# Altium schematic sheet 5 - Position2Go_PowerSupply_and_Connectors.SchDoc
size A3; Release: RC00; PageSetup: Record=PageOptions|CenterHorizontal=True|CenterVertical=True|PrintScale=1.01|XCorrection=1.00|YCorrection=1.00|PrintKind=0|BorderSize=5000000|LeftOffset=0|BottomOffset=0|Orientation=2|PaperLength=1000|PaperWidth=1000|Scale=100|PaperSource=7|PrintQuality=-4|MediaType=1|DitherType=10|PaperKind=A3|PrintScaleMode=1; Doc_ConfidentialStatus: <Doc_ConfidentialStatus>; Doc_Preliminary: <Doc_Preliminary>
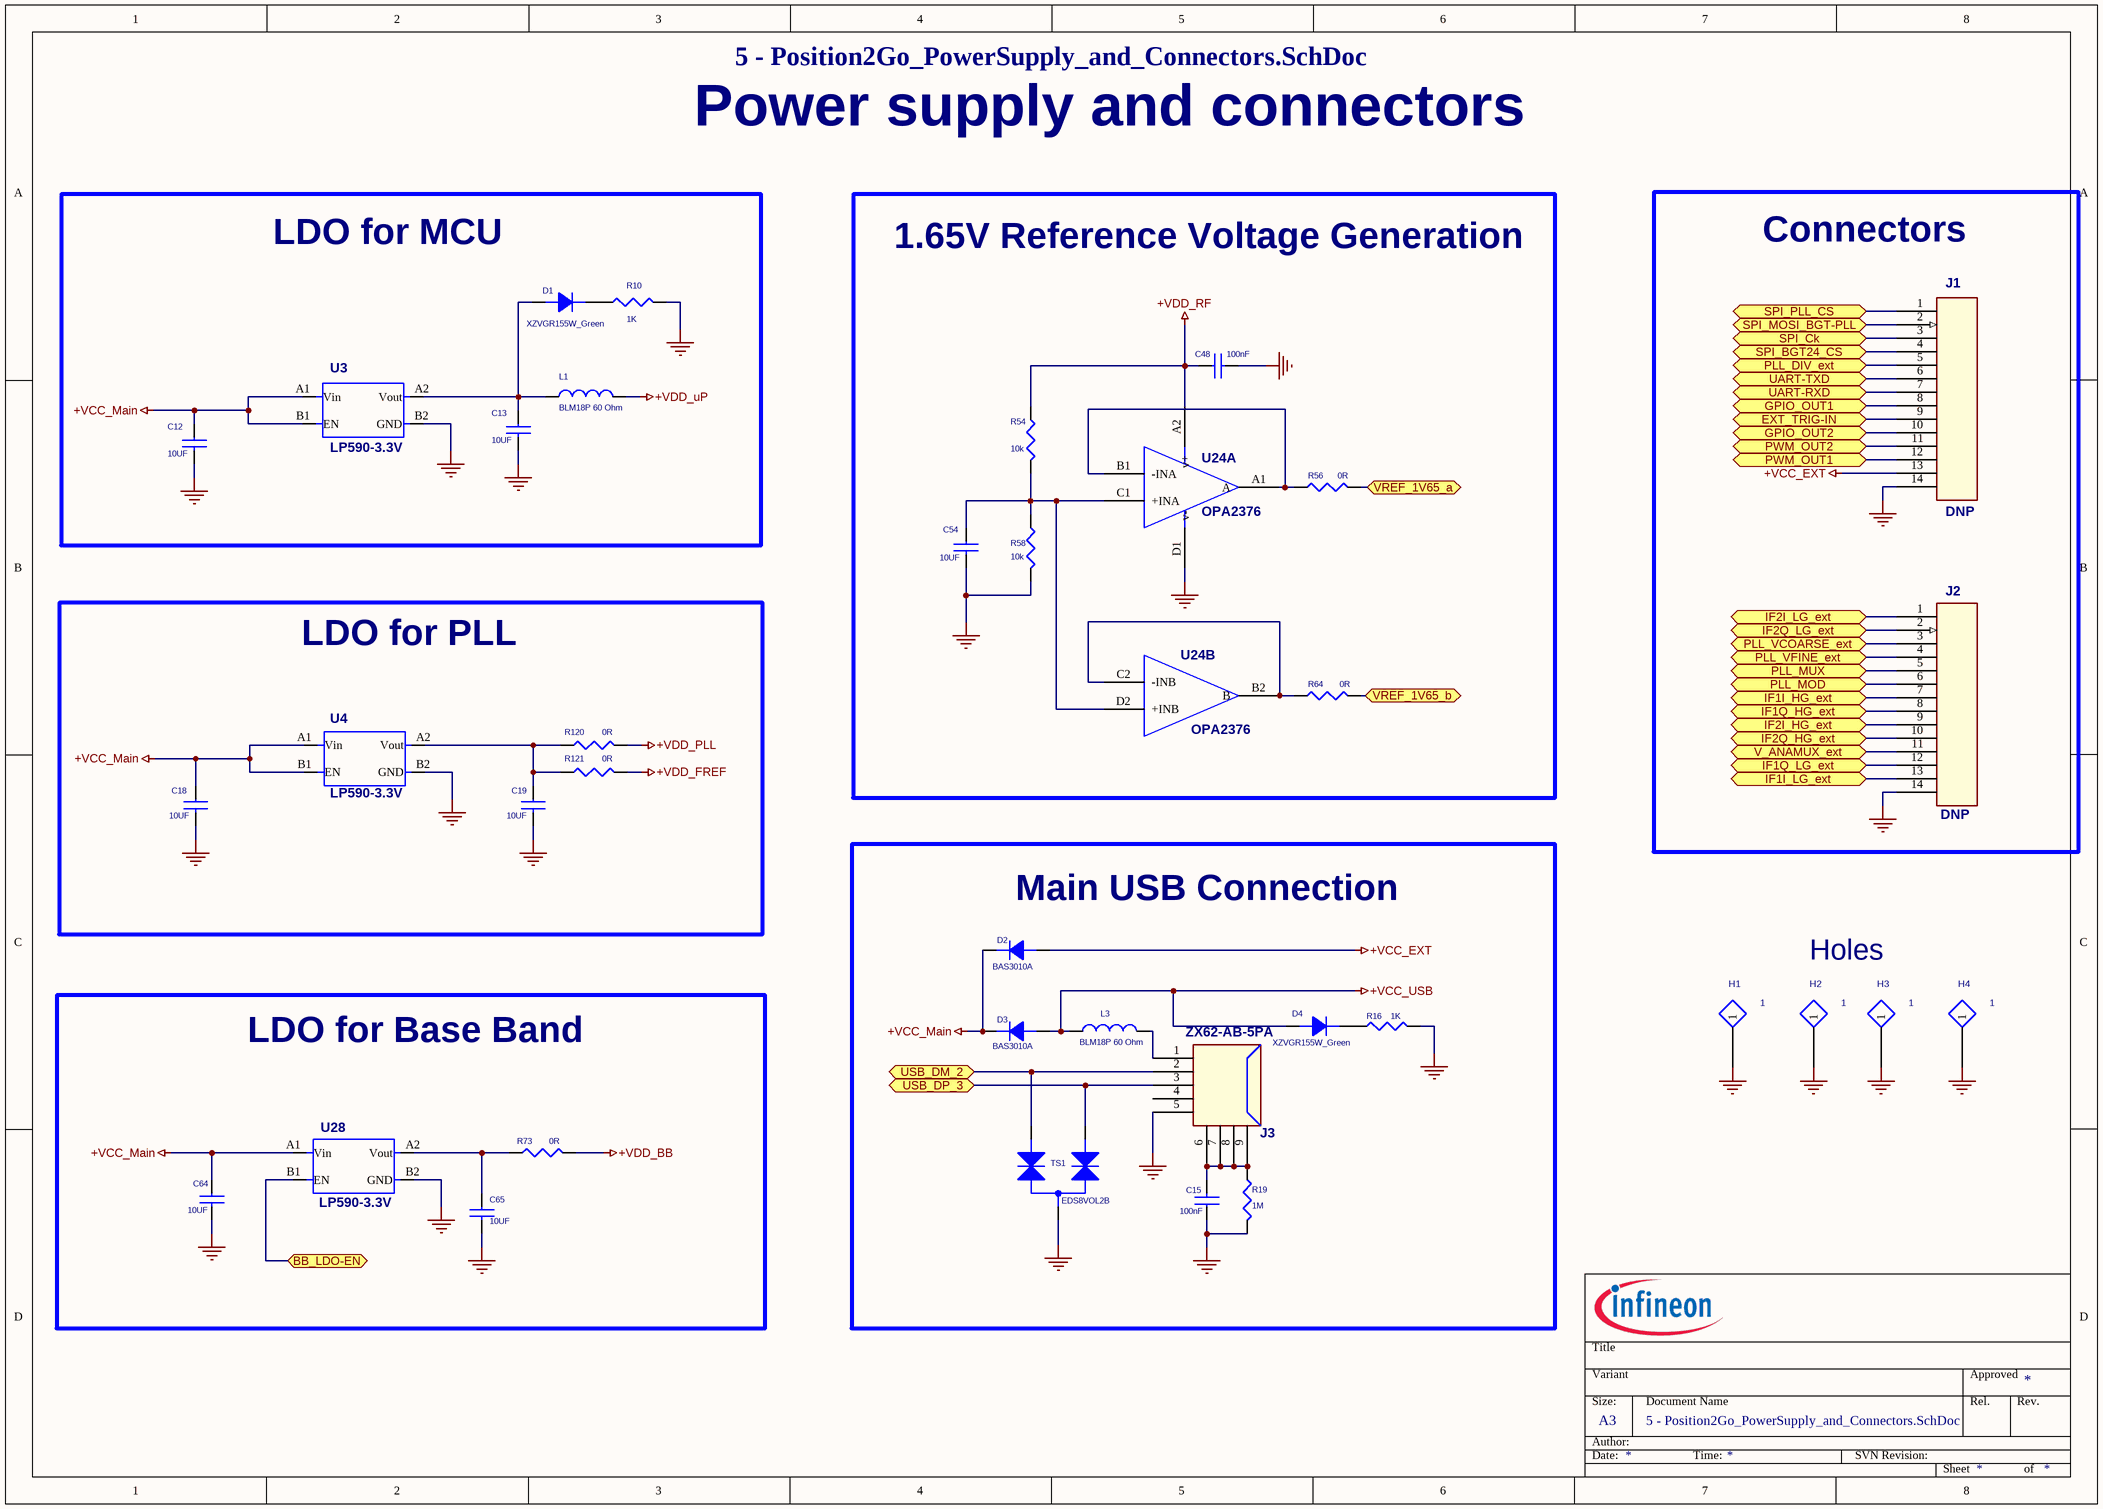
[diagram p0: 5 - Position2Go_PowerSupply_and_Connectors.SchDoc]

## Parts
C12  10UF  [0402_durac]
C13  10UF  [0402_durac]
C15  100nF  [0402_durac]
C18  10UF  [0402_durac]
C19  10UF  [0402_durac]
C48  100nF  [C_0201]
C54  10UF  [0402_durac]
C64  10UF  [0402_durac]
C65  10UF  [0402_durac]
D1  XZVGR155W_Green  [LED_0201]
D2  BAS3010A  [sod323]
D3  BAS3010A  [sod323]
D4  XZVGR155W_Green  [LED_0201]
H1  1  [vite_1mm]  (no BOM)
H2  1  [vite_1mm]  (no BOM)
H3  1  [vite_1mm]  (no BOM)
H4  1  [vite_1mm]  (no BOM)
J1  DNP  [conn_14_90deg_th]
J2  DNP  [conn_14_90deg_th]
J3  ZX62-AB-5PA  [micro_AB_ZX62]
L1  BLM18P 60 Ohm  [L_0603]
L3  BLM18P 60 Ohm  [L_0603]
R10  1K  [R_0201]
R16  1K  [R_0201]
R19  1M  [R_0201]
R54  10k  [R_0201]
R56  0R  [R_0201]
R58  10k  [R_0201]
R64  0R  [R_0201]
R73  0R  [0603]
R120  0R  [0603]
R121  0R  [0603]
TS1  EDS8VOL2B  [ESD8VOL2B]
U3  LP590-3.3V  [YKE4]
U4  LP590-3.3V  [YKE4]
U24  OPA2376  [OPA2376_DSBGA]  (parts A,B of 2)
U28  LP590-3.3V  [YKE4]

## Blocks framed on the sheet
LDO for MCU: C12 C13 D1 L1 R10 U3
1.65V Reference Voltage Generation: C48 C54 R54 R56 R58 R64 U24
Connectors: J1 J2
LDO for PLL: C18 C19 R120 R121 U4
Main USB Connection: C15 D2-D4 J3 L3 R16 R19 TS1
LDO for Base Band: C64 C65 R73 U28

## Ports
BB_LDO-EN (bidir), EXT_TRIG-IN (bidir), GPIO_OUT1 (bidir), GPIO_OUT2 (bidir), IF1I_HG_ext (bidir), IF1I_LG_ext (bidir), IF1Q_HG_ext (bidir), IF1Q_LG_ext (bidir), IF2I_HG_ext (bidir), IF2I_LG_ext (bidir), IF2Q_HG_ext (bidir), IF2Q_LG_ext (bidir), PLL_DIV_ext (bidir), PLL_MOD (bidir), PLL_MUX (bidir), PLL_VCOARSE_ext (bidir), PLL_VFINE_ext (bidir), PWM_OUT1 (bidir), PWM_OUT2 (bidir), SPI_BGT24_CS (bidir), SPI_Ck (bidir), SPI_MOSI_BGT-PLL (bidir), SPI_PLL_CS (bidir), UART-RXD (bidir), UART-TXD (bidir), USB_DM_2 (bidir), USB_DP_3 (bidir), V_ANAMUX_ext (bidir), VREF_1V65_a (bidir), VREF_1V65_b (bidir)

## Nets
+VCC_EXT: D2.2(A) J1.13
+VCC_Main: C12.1 C18.1 C64.1 D2.1(K) D3.1(K) U3.A1(Vin) U3.B1(EN) U4.A1(Vin) U4.B1(EN) U28.A1(Vin)
+VCC_USB: D3.2(A) D4.2(A) L3.2
+VDD_BB: R73.1
+VDD_FREF: R121.2
+VDD_PLL: R120.2
+VDD_RF: C48.1 R54.1 U24.A2(v+)
+VDD_uP: L1.2
GND_POWER: C12.2 C13.2 C15.1 C18.2 C19.2 C48.2 C54.2 C64.2 C65.2 H1.1 H2.1 H3.1 H4.1 J1.14 J2.14 J3.5 R10.1 R16.1 R19.2 R58.2 TS1.3 U3.B2(GND) U4.B2(GND) U24.D1(v-) U28.B2(GND)
BB_LDO-EN: U28.B1(EN) ; port BB_LDO-EN
EXT_TRIG-IN: J1.9 ; port EXT_TRIG-IN
GPIO_OUT1: J1.8 ; port GPIO_OUT1
GPIO_OUT2: J1.10 ; port GPIO_OUT2
IF1I_HG_ext: J2.7 ; port IF1I_HG_ext
IF1I_LG_ext: J2.13 ; port IF1I_LG_ext
IF1Q_HG_ext: J2.8 ; port IF1Q_HG_ext
IF1Q_LG_ext: J2.12 ; port IF1Q_LG_ext
IF2I_HG_ext: J2.9 ; port IF2I_HG_ext
IF2I_LG_ext: J2.1 ; port IF2I_LG_ext
IF2Q_HG_ext: J2.10 ; port IF2Q_HG_ext
IF2Q_LG_ext: J2.2 ; port IF2Q_LG_ext
PLL_DIV_ext: J1.5 ; port PLL_DIV_ext
PLL_MOD: J2.6 ; port PLL_MOD
PLL_MUX: J2.5 ; port PLL_MUX
PLL_VCOARSE_ext: J2.3 ; port PLL_VCOARSE_ext
PLL_VFINE_ext: J2.4 ; port PLL_VFINE_ext
PWM_OUT1: J1.12 ; port PWM_OUT1
PWM_OUT2: J1.11 ; port PWM_OUT2
SPI_BGT24_CS: J1.4 ; port SPI_BGT24_CS
SPI_Ck: J1.3 ; port SPI_Ck
SPI_MOSI_BGT-PLL: J1.2 ; port SPI_MOSI_BGT-PLL
SPI_PLL_CS: J1.1 ; port SPI_PLL_CS
UART-RXD: J1.7 ; port UART-RXD
UART-TXD: J1.6 ; port UART-TXD
USB_DM_2: J3.2 TS1.1 ; port USB_DM_2
USB_DP_3: J3.3 TS1.2 ; port USB_DP_3
V_ANAMUX_ext: J2.11 ; port V_ANAMUX_ext
VREF_1V65_a: R56.2 ; port VREF_1V65_a
VREF_1V65_b: R64.2 ; port VREF_1V65_b
NetC13_1: C13.1 D1.2(A) L1.1 U3.A2(Vout)
NetC15_2: C15.2 J3.6(GND) J3.7(GND) J3.8(GND) J3.9(GNd) R19.1
NetC19_1: C19.1 R120.1 R121.1 U4.A2(Vout)
NetC54_1: C54.1 R54.2 R58.1 U24.C1(+INA) U24.D2(+INB)
NetC65_1: C65.1 R73.2 U28.A2(Vout)
NetD1_1: D1.1(K) R10.2
NetD4_1: D4.1(K) R16.2
NetJ3_1: J3.1 L3.1
NetR56_1: R56.1 U24.A1(A) U24.B1(-INA)
NetR64_1: R64.1 U24.B2(B) U24.C2(-INB)

Not connected (* = marked no-connect by the designer): J3 4

## Notes on the sheet
- Power supply and connectors
- Holes
- Title
- Variant
- Approved
- Date:
- Author:
- Size:
- A3
- Document Name
- Time:
- SVN Revision:
- Rel.
- Rev.
- Sheet
- of

## Library data of the parts
C12 C13 C18 C19 C54 C64 C65 = 10UF: Temperature coefficient: X5R; Tolerance: 20%; Voltage: 10V; code_DK: 1276-1450-1-ND; Part Type: capacitor\ceramic
  C13: Value: 10uF
C15 = CAP NP: 100nF  ±5%  16V  X7R; code_DK: 490-6327-1-ND
C48 = 100nF_Dup1: code_DK: 490-10430-1-ND; Voltage: 50V; Tolerance: 5%; Part Type: capacitor\ceramic
D1 D4 = LED_0201_GREEN: code_DK_reel: 475-1193-6-ND; code_DK: 1497-1300-1-ND
D2 D3 = BAS3010A: code_DK: BAS3010A-03WE6327INCT-ND
H1-H4 = vite_1mm: code_DK: N_M
J1 J2 = 14pos_TH_90_singola_fila: NB Not Fitted; code_DK: 732-5344-ND
J3 = CON_MICRO_AB: code_DK: H11580TR-ND
L1 L3 = blm18 p 60 ohm: code_DK: 490-1036-1-ND
R10 R16 = 1K: Power: 0.063W; tolerance: 1%; code_DK: 311-1KMCT-ND; size: 0201
R19 = 1M: Power: 0.063W; tolerance: 1%; code_DK: 311-1MMCT-ND; size: 0201
R54 R58 = 10K_Dup1: code_DK_reel: 311-1KMDKR-ND; code_DK: 311-10.0KMCT-ND; tolerance: 1%; Power: 0.063W; size: 0201
R56 R64 = 0_Dup2: code_DK: 311-0.0NCT-ND; tolerance: 1%; Power: 0.063W; size: 0201
R73 R120 R121 = 0: 0R 0603; code_DK: MCT0603-0.0-ZZDKR-ND; tolerance: 1%; Power: 0.125W; size: 0603
TS1 = ESD8VOL2B: code_DK: ESD8V0L2B-03LE6327INCT-ND
U3 U4 U28 = LP5907_BGA: code_DK: 296-35104-1-ND; OriginalSymbolOrigin: (20000,20000); DeviceNumbering: Alpha; DeviceDesignator: A; DevicesInPackage: 1; IsHeterogeneous: False; DevicesInView: 1
U24 = OPA2376_DSBGA: code_DK: 296-39119-1-ND